# EAGLE schematic USB Dash Daughter Board (EAGLE 8.4.1)
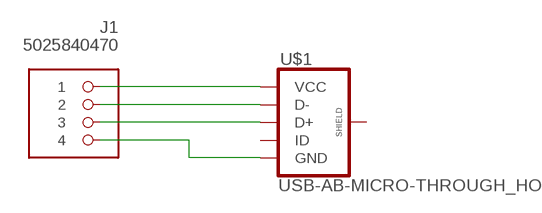
[diagram p0: schematic, sheet 1]

## Parts
J1  5025840470  MOLEX_CLICKMATE-4-VERTICAL  [MOLEX-CLIKMATE-4-VERTICAL-HEADER]
U$1  USB-AB-MICRO-THROUGH_HOLE  [USB-AB-MICRO-THROUGH_HOLE]

## Nets
N$1: J1.1 U$1.P$5(VCC)
N$2: J1.2 U$1.P$4(D-)
N$3: J1.3 U$1.P$3(D+)
N$4: J1.4 U$1.P$1(GND)
Unconnected: U$1.P$2(ID) U$1.P$6(SHIELD)

## Library data of the parts
J1 = FormE:MOLEX_CLICKMATE-4-VERTICAL: 5025840470
U$1 = FormE:USB-AB-MICRO-THROUGH_HOLE